# Altium schematic sheet Main.SchDoc
size A3
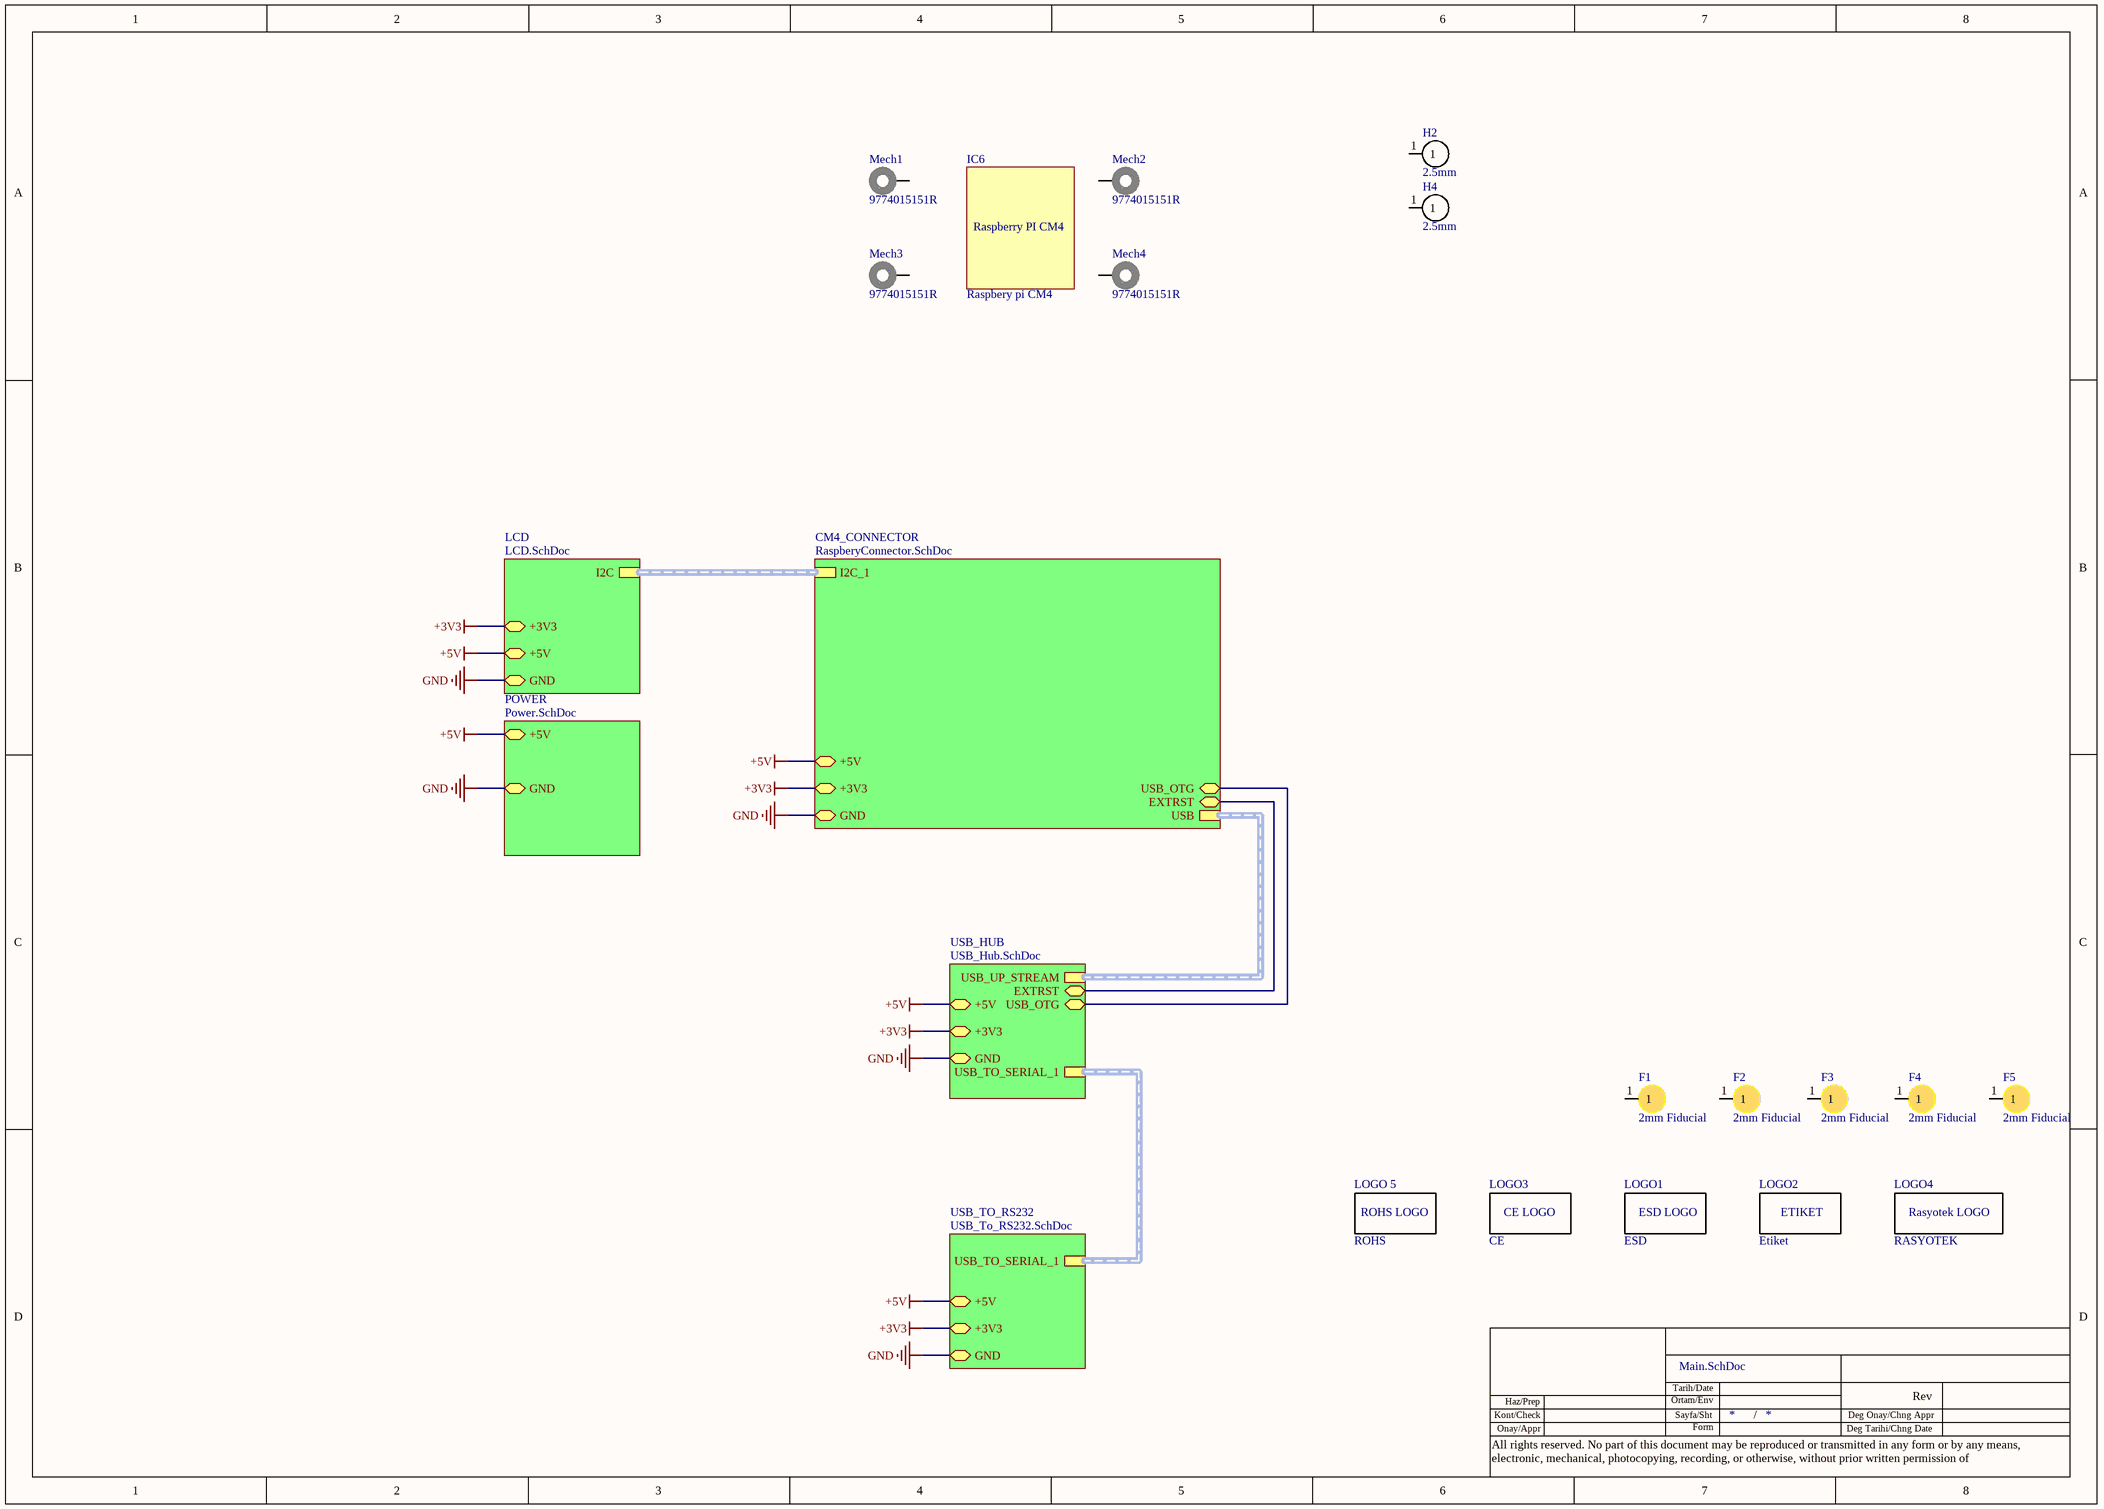
[diagram p0: Main.SchDoc]

## Parts
F1  2mm Fiducial  [2mm Fiducial]
F2  2mm Fiducial  [2mm Fiducial]
F3  2mm Fiducial  [2mm Fiducial]
F4  2mm Fiducial  [2mm Fiducial]
F5  2mm Fiducial  [2mm Fiducial]
H2  2.5mm  [2.5mm hole]
H4  2.5mm  [2.5mm hole]
IC6  Raspbery pi CM4  [CM4_BOARD_SIDE]
LOGO1  ESD  [ESD]
LOGO2  Etiket  [ETIKET]
LOGO3  CE  [CE]
LOGO4  RASYOTEK  [Rasyotek]
LOGO_5  ROHS  [ROHS]
Mech1  9774015151R  [9774015151]
Mech2  9774015151R  [9774015151]
Mech3  9774015151R  [9774015151]
Mech4  9774015151R  [9774015151]

## Sub-sheets
CM4_CONNECTOR = RaspberyConnector.SchDoc: USB (harness USB), +5V (bidir), +3V3 (bidir), GND (bidir), EXTRST (bidir), I2C_1 (harness I2C), USB_OTG (bidir)
LCD = LCD.SchDoc: I2C (harness I2C), +5V (bidir), GND (bidir), +3V3 (bidir)
POWER = Power.SchDoc: +5V (bidir), GND (bidir)
USB_HUB = USB_Hub.SchDoc: USB_UP_STREAM (harness USB), USB_TO_SERIAL_1 (harness USB), +5V (bidir), +3V3 (bidir), GND (bidir), EXTRST (bidir), USB_OTG (bidir)
USB_TO_RS232 = USB_To_RS232.SchDoc: USB_TO_SERIAL_1 (harness USB), +3V3 (bidir), GND (bidir), +5V (bidir)

## Nets
+3V3: sheet USB_TO_RS232/+3V3, sheet USB_HUB/+3V3, sheet CM4_CONNECTOR/+3V3, sheet LCD/+3V3
+5V: sheet USB_TO_RS232/+5V, sheet USB_HUB/+5V, sheet CM4_CONNECTOR/+5V, sheet POWER/+5V, sheet LCD/+5V
GND: sheet USB_TO_RS232/GND, sheet USB_HUB/GND, sheet CM4_CONNECTOR/GND, sheet POWER/GND, sheet LCD/GND
(unnamed): sheet USB_HUB/EXTRST, sheet CM4_CONNECTOR/EXTRST
(unnamed): sheet USB_HUB/USB_OTG, sheet CM4_CONNECTOR/USB_OTG

Not connected (* = marked no-connect by the designer): F1 1; F2 1; F3 1; F4 1; F5 1; H2 1; H4 1; Mech1 1; Mech2 1; Mech3 1; Mech4 1

## Buses and harness runs
harness sheet CM4_CONNECTOR/I2C_1 = sheet LCD/I2C
harness sheet CM4_CONNECTOR/USB = sheet USB_HUB/USB_UP_STREAM
harness sheet USB_HUB/USB_TO_SERIAL_1 = sheet USB_TO_RS232/USB_TO_SERIAL_1

## Notes on the sheet
- Tarih/Date
- Kont/Check
- Onay/Appr
- Haz/Prep
- Ortam/Env
- Sayfa/Sht
- Form
- /
- Deg Tarihi/Chng Date
- Deg Onay/Chng Appr
- Rev
- All rights reserved. No part of this document may be reproduced or transmitted in any form or by any means, electronic, mechanical, photocopying, recording, or otherwise, without prior written permission of
- (in symbol CM4) Raspberry PI CM4
- (in symbol Etiket) ETIKET
- (in symbol RASYOTEK) Rasyotek LOGO
- (in symbol ROHS) ROHS LOGO

## Library data of the parts
H2 H4 = 2.5 mm Hole: 2.5mm hole; Category: Hole
IC6 = CM4: Category: Module
LOGO1 = ESD: ESD LOGO; Category: Logo
LOGO2 = Etiket: Etiket kutu; Category: Logo
LOGO3 = CE: CE LOGO
LOGO_5 = ROHS: ROHS Logo
Mech1-Mech4 = 9774015151R: RND STNDFF M2.5X0.45 STEEL 1.5MM; Manufacturer: Wurth Electronics; Plating: Tin; Threaded/Unthreaded: Threaded; Outside Diameter: 0.201inch; Supplier 1: Digi-Key; Supplier Part Number 1: 732-7068-1-ND; Manufacturer Part Number: 9774015151R; Stock 1: 20988; Pricing 1: 1 = 1,09000, 10 = 1,03000, 50 = 0,91800, 100 = 0,84000, 500 = 0,78400 (USD); RoHS: Yes; Material: Steel; Length: 0.114inch; REACH SVHC: Unknown; ComponentLink1URL: http://www.mouser.com/ds/2/445/9774015151R-611426.pdf?src-supplier=Mouser; ComponentLink1Description: http://www.mouser.com/ds/2/445/9774015151R-611426.pdf?src-supplier=Mouser; ComponentLink2URL: http://www.farnell.com/datasheets/1960360.pdf?src-supplier=Farnell; ComponentLink2Description: http://www.farnell.com/datasheets/1960360.pdf?src-supplier=Farnell; ComponentLink3URL: https://media.digikey.com/pdf/Data%20Sheets/Wurth%20Electronics%20PDFs/WA-SMSx_Performance_Flyer.pdf?src-supplier=Digi-Key; ComponentLink3Description: https://media.digikey.com/pdf/Data%20Sheets/Wurth%20Electronics%20PDFs/WA-SMSx_Performance_Flyer.pdf?src-supplier=Digi-Key; ComponentLink4URL: http://www.farnell.com/datasheets/1960360.pdf?src-supplier=Element14; ComponentLink4Description: http://www.farnell.com/datasheets/1960360.pdf?src-supplier=Element14; ComponentLink5URL: http://www.farnell.com/datasheets/1960360.pdf?src-supplier=Newark; ComponentLink5Description: http://www.farnell.com/datasheets/1960360.pdf?src-supplier=Newark; Category: Hardware, Fasteners, Accessories Board Spacers, Standoffs
F1-F5 = 2mm Fiducial: Category: Fiducial
LOGO4 = RASYOTEK: Category: Logo